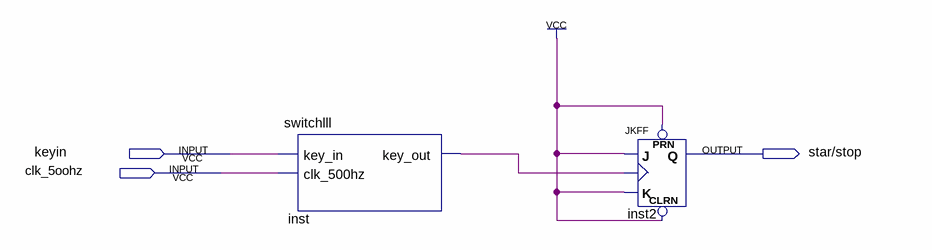
[diagram p0: schematic sheet]
// Quartus schematic debounce.bdf as structural Verilog: 2 symbols, 3 pins
module debounce (
  input  keyin,
  input  clk_5oohz,
  output \star/stop 
);

  wire inst_key_out;

  switchlll inst (.key_in(keyin), .clk_500hz(clk_5oohz), .key_out(inst_key_out));
  JKFF inst2 (.PRN(1'b1), .CLRN(1'b1), .K(1'b1), .J(1'b1), .CLK(inst_key_out), .Q(\star/stop ));
endmodule
